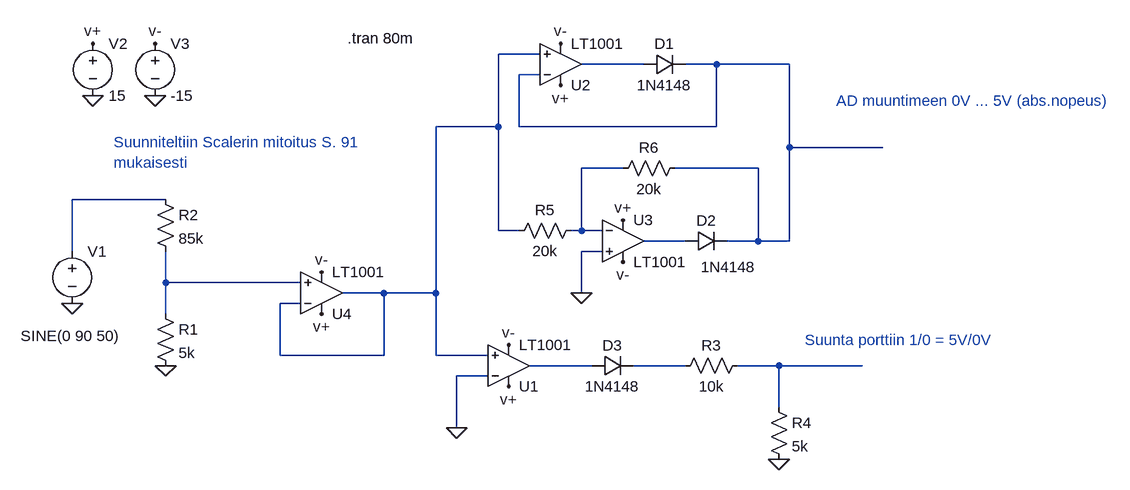
[diagram p0: schematic Liikeanturi.asc]
Liikeanturi.asc, the LTspice schematic file:
Version 4
SHEET 1 1404 680
WIRE 448 -128 384 -128
WIRE 608 -112 512 -112
WIRE 720 -112 672 -112
WIRE 832 -112 720 -112
WIRE 448 -96 416 -96
WIRE 384 -16 384 -128
WIRE 384 -16 288 -16
WIRE 416 -16 416 -96
WIRE 720 -16 720 -112
WIRE 720 -16 416 -16
WIRE 832 16 832 -112
WIRE 976 16 832 16
WIRE 576 48 512 48
WIRE 784 48 656 48
WIRE -128 96 -272 96
WIRE 384 144 384 -16
WIRE 416 144 384 144
WIRE 512 144 512 48
WIRE 512 144 496 144
WIRE 544 144 512 144
WIRE 672 160 608 160
WIRE 784 160 784 48
WIRE 784 160 736 160
WIRE 832 160 832 16
WIRE 832 160 784 160
WIRE -272 176 -272 96
WIRE 544 176 512 176
WIRE -128 224 -128 176
WIRE 80 224 -128 224
WIRE 208 240 144 240
WIRE 288 240 288 -16
WIRE 288 240 208 240
WIRE 512 240 512 176
WIRE 80 256 48 256
WIRE -128 272 -128 224
WIRE 48 336 48 256
WIRE 208 336 208 240
WIRE 208 336 48 336
WIRE 288 336 288 240
WIRE 368 336 288 336
WIRE 528 352 432 352
WIRE 672 352 592 352
WIRE 816 352 752 352
WIRE 944 352 816 352
WIRE 368 368 320 368
WIRE 816 416 816 352
WIRE 320 448 320 368
FLAG 320 448 0
FLAG -272 256 0
FLAG -144 -64 0
FLAG -240 -64 0
FLAG -128 352 0
FLAG 512 240 0
FLAG -144 -144 v-
FLAG 576 192 v-
FLAG 400 320 v-
FLAG 480 -144 v-
FLAG 576 128 v+
FLAG 400 384 v+
FLAG -240 -144 v+
FLAG 480 -80 v+
FLAG 816 496 0
FLAG 112 208 v-
FLAG 112 272 v+
SYMBOL voltage -272 160 R0
WINDOW 3 -79 146 Left 2
WINDOW 123 0 0 Left 2
WINDOW 39 0 0 Left 2
SYMATTR InstName V1
SYMATTR Value SINE(0 90 50)
SYMBOL voltage -240 -160 R0
WINDOW 123 0 0 Left 2
WINDOW 39 0 0 Left 2
SYMATTR InstName V2
SYMATTR Value 15
SYMBOL voltage -144 -160 R0
WINDOW 123 0 0 Left 2
WINDOW 39 0 0 Left 2
SYMATTR InstName V3
SYMATTR Value -15
SYMBOL res -144 256 R0
SYMATTR InstName R1
SYMATTR Value 5k
SYMBOL res -144 80 R0
SYMATTR InstName R2
SYMATTR Value 85k
SYMBOL Opamps\\LT1001 400 416 M180
SYMATTR InstName U1
SYMBOL Opamps\\LT1001 480 -48 M180
SYMATTR InstName U2
SYMBOL Opamps\\LT1001 576 96 R0
SYMATTR InstName U3
SYMBOL diode 608 -96 R270
WINDOW 0 32 32 VTop 2
WINDOW 3 0 32 VBottom 2
SYMATTR InstName D1
SYMATTR Value 1N4148
SYMBOL diode 672 176 R270
WINDOW 0 32 32 VTop 2
WINDOW 3 -8 66 VBottom 2
SYMATTR InstName D2
SYMATTR Value 1N4148
SYMBOL diode 528 368 R270
WINDOW 0 32 32 VTop 2
WINDOW 3 0 32 VBottom 2
SYMATTR InstName D3
SYMATTR Value 1N4148
SYMBOL res 768 336 R90
WINDOW 0 0 56 VBottom 2
WINDOW 3 32 56 VTop 2
SYMATTR InstName R3
SYMATTR Value 10k
SYMBOL res 800 400 R0
SYMATTR InstName R4
SYMATTR Value 5k
SYMBOL res 512 128 R90
WINDOW 0 0 56 VBottom 2
WINDOW 3 32 56 VTop 2
SYMATTR InstName R5
SYMATTR Value 20k
SYMBOL res 672 32 R90
WINDOW 0 0 56 VBottom 2
WINDOW 3 32 56 VTop 2
SYMATTR InstName R6
SYMATTR Value 20k
SYMBOL Opamps\\LT1001 112 304 M180
SYMATTR InstName U4
TEXT 152 -152 Left 2 !.tran 80m
TEXT 904 -56 Left 2 ;AD muuntimeen 0V ... 5V (abs.nopeus)
TEXT 856 312 Left 2 ;Suunta porttiin 1/0 = 5V/0V
TEXT -208 8 Left 2 ;Suunniteltiin Scalerin mitoitus S. 91\nmukaisesti

The netlist it stands for:
* Liikeanturi.asc
V1 N005 0 SINE(0 90 50)
V2 v+ 0 15
V3 v- 0 -15
R1 N007 0 5k
R2 N005 N007 85k
XU1 N001 0 v+ v- N008 LT1001  ; pins In+ In- V+ V- OUT
XU2 N001 N003 v+ v- N002 LT1001  ; pins In+ In- V+ V- OUT
XU3 0 N004 v+ v- N006 LT1001  ; pins In+ In- V+ V- OUT
D1 N002 N003 1N4148
D2 N006 N003 1N4148
D3 N008 N009 1N4148
R3 N010 N009 10k
R4 N010 0 5k
R5 N004 N001 20k
R6 N003 N004 20k
XU4 N007 N001 v+ v- N001 LT1001  ; pins In+ In- V+ V- OUT
.model D D
.lib standard.dio
.tran 80m
* AD muuntimeen 0V ... 5V (abs.nopeus)
* Suunta porttiin 1/0 = 5V/0V
* Suunniteltiin Scalerin mitoitus S. 91
* mukaisesti
.lib LTC.lib
.backanno
.end